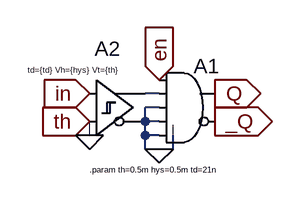
[diagram p0: schematic comp_en.asc]
comp_en.asc, the LTspice schematic file:
Version 4
SHEET 1 1120 680
WIRE 272 112 256 112
WIRE 272 128 256 128
WIRE 256 144 256 128
WIRE 272 144 256 144
WIRE 256 160 256 144
WIRE 272 160 256 160
WIRE 256 176 256 160
WIRE 272 176 256 176
WIRE 288 176 288 160
WIRE 288 176 272 176
FLAG 192 144 th
IOPIN 192 144 In
FLAG 192 112 in
IOPIN 192 112 In
FLAG 272 96 en
IOPIN 272 96 In
FLAG 192 160 0
FLAG 336 112 Q
IOPIN 336 112 Out
FLAG 336 144 _Q
IOPIN 336 144 Out
FLAG 272 176 0
SYMBOL Digital\\diffschmitt 192 64 R0
WINDOW 3 -71 21 Left 0
WINDOW 0 6 -4 Left 2
SYMATTR Value td={td} Vh={hys} Vt={th}
SYMATTR InstName A2
SYMATTR Value2 trise=1n tfall=1n
SYMBOL Digital\\and 304 64 R0
SYMATTR InstName A1
TEXT 192 200 Left 0 !.param th=0.5m hys=0.5m td=21n

The netlist it stands for:
* comp_en.asc
A2 in th 0 0 0 0 N001 0 SCHMITT td={td} Vh={hys} Vt={th} trise=1n tfall=1n
A1 en N001 0 0 0 _Q Q 0 AND
.param th=0.5m hys=0.5m td=21n
.backanno
.end